# EAGLE design sh (EAGLE 9.4.2)
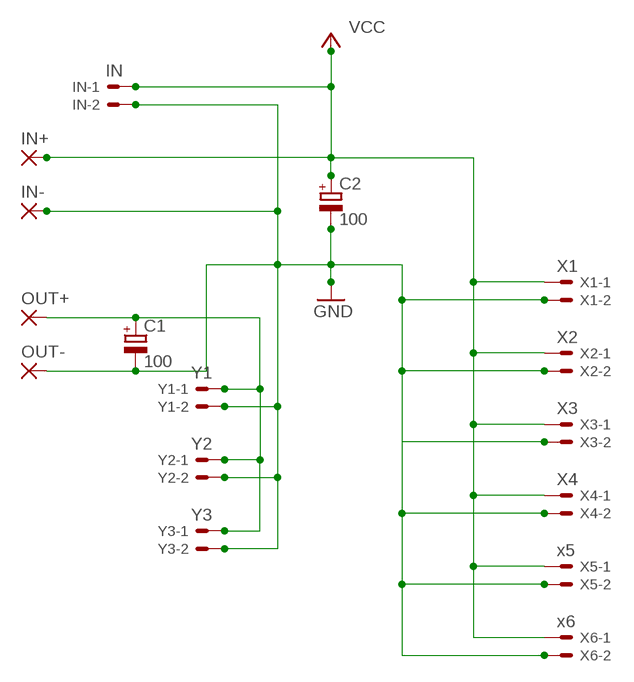
[diagram p0: schematic, sheet 1]

## Parts
C1  100  CPOL-EUE5-10.5  [E5-10,5]
C2  100  CPOL-EUE5-10.5  [E5-10,5]
IN  IN  C-GRID-02-70543  [70543-02]
IN+  3,17/1,3  [3,17/1,3]
IN-  3,17/1,3  [3,17/1,3]
OUT+  3,17/1,3  [3,17/1,3]
OUT-  3,17/1,3  [3,17/1,3]
X1  X1  C-GRID-02-70543  [70543-02]
X2  X2  C-GRID-02-70543  [70543-02]
X3  X3  C-GRID-02-70543  [70543-02]
X4  X4  C-GRID-02-70543  [70543-02]
X5  x5  C-GRID-02-70543  [70543-02]
X6  x6  C-GRID-02-70543  [70543-02]
Y1  Y1  C-GRID-02-70543  [70543-02]
Y2  Y2  C-GRID-02-70543  [70543-02]
Y3  Y3  C-GRID-02-70543  [70543-02]

## Nets
GND: C1.- C2.- IN-.1(P) IN.2 OUT-.1(P) X1.2 X2.2 X3.2 X4.2 X5.2 X6.2 Y1.2 Y2.2 Y3.2
N$3: C1.+ OUT+.1(P) Y1.1 Y2.1 Y3.1
VCC: C2.+ IN+.1(P) IN.1 X1.1 X2.1 X3.1 X4.1 X5.1 X6.1

## Library data of the parts
C1 C2 = rcl:CPOL-EU: POLARIZED CAPACITOR, European symbol; SPICEPREFIX: C
IN Y1-Y3 = con-molex:C-GRID-02: CONNECTOR wire to board 2.54 mm (0.100") pitch header; MF: MOLEX; OC_FARNELL: unknown; OC_NEWARK: unknown
IN+ IN- OUT+ OUT- = wirepad:3,17/1,3: THROUGH-HOLE PAD
X1-X6 = con-molex:C-GRID-02: CONNECTOR wire to board 2.54 mm (0.100") pitch header; OC_FARNELL: unknown; OC_NEWARK: unknown

## Board
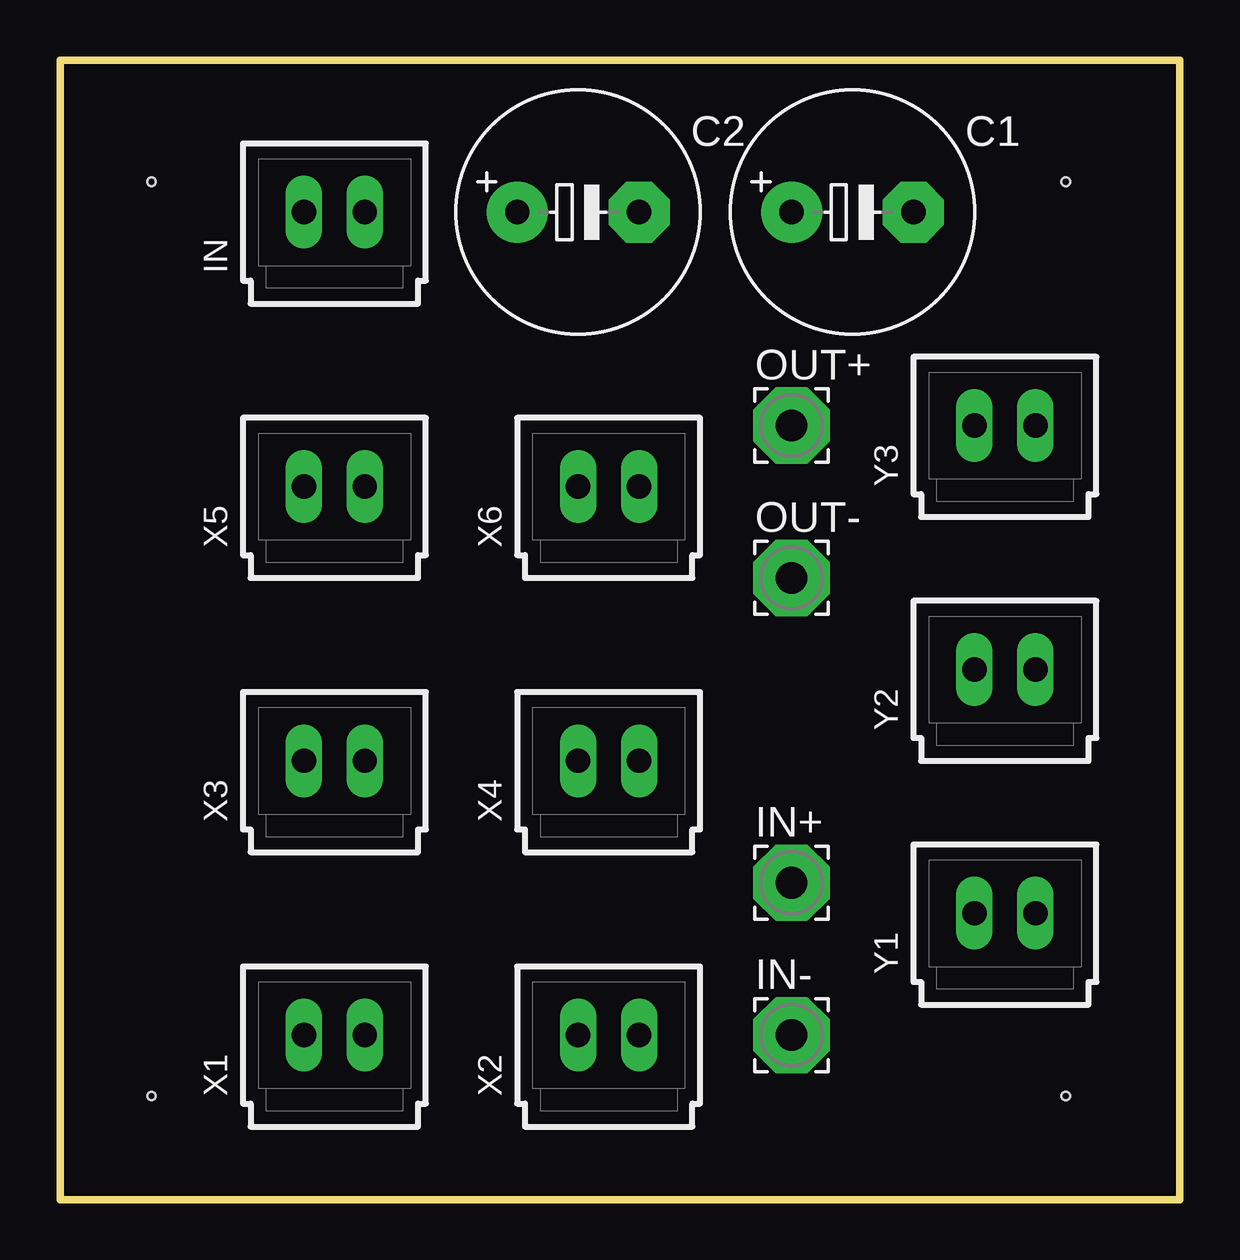
[diagram p1: board, top side]
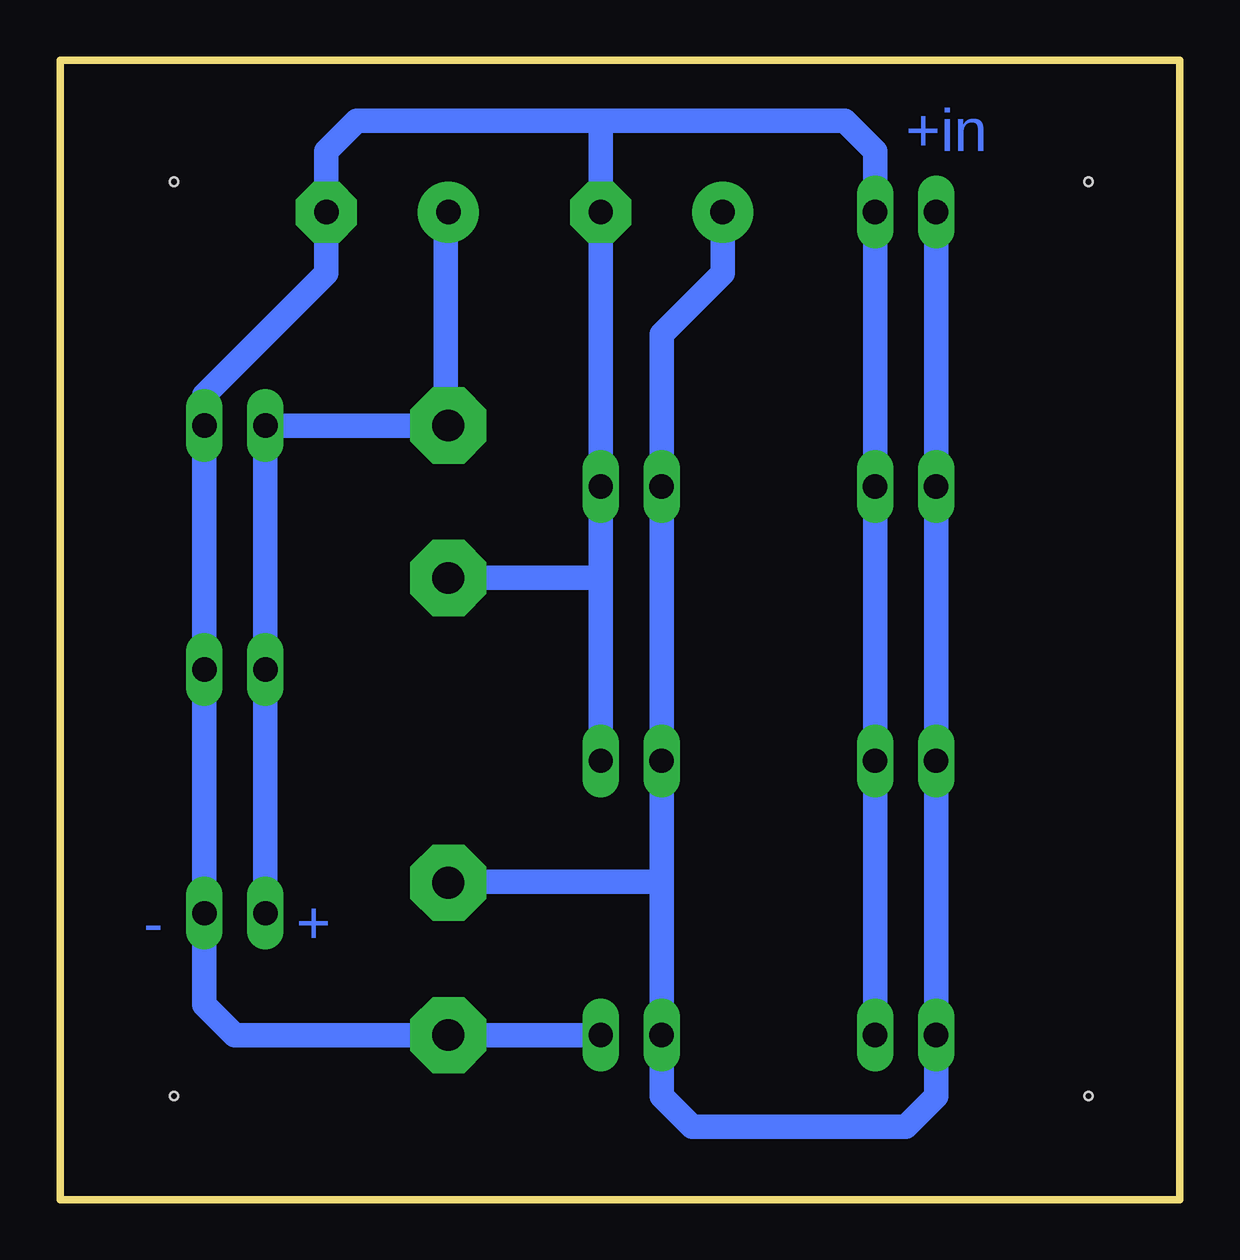
[diagram p2: board, bottom side, seen from below]

Size 46.66 x 47.49 mm. Coordinates in mm from the lower left corner, seen from the top.
Outline: 0,0 46.66,0 46.66,47.49 0,47.49 0,0
Copper layers (1*16): Top 0.035mm / dielectric 1.5mm / Bottom 0.035mm
Design rules "default": minimum track width 6mil, minimum drill 0.35mm, track to track 6mil, track to pad 6mil, pad to pad 6mil, via to via 6mil, smd to smd 6mil, copper to edge 40mil, drill to drill 6mil, minimum pad ring 10mil, minimum via ring 8mil, stop-mask expansion 4mil, vias tented up to drill 0mil, thermal gap 10mil
Holes 0.35 mm at 3.81,42.42 41.91,42.42 41.91,4.32 3.81,4.32

### Footprints (pad centres in the part's own frame; a part is rotated, then mirrored left to right if it is on the bottom)
E5-10,5 = drill 1.016 pad 2.54: + -2.54,0 | drill 1.016 pad 2.54 octagon: - 2.54,0
70543-02 = drill 1.016 long: 1 -1.27,0; 2 1.27,0
3,17/1,3 = drill 1.321 pad 3.175 octagon: 1 0,0

### Placement (x,y rotation side)
C1  33.02,41.15 0 top
C2  21.59,41.15 0 top
IN  11.43,41.15 0 top
IN+  30.48,13.21 0 top
IN-  30.48,6.86 0 top
OUT+  30.48,32.26 0 top
OUT-  30.48,25.91 0 top
X1  11.43,6.86 0 top
X2  22.86,6.86 0 top
X3  11.43,18.29 0 top
X4  22.86,18.29 0 top
X5  11.43,29.72 0 top
X6  22.86,29.72 0 top
Y1  39.37,11.94 0 top
Y2  39.37,22.1 0 top
Y3  39.37,32.26 0 top

### Tracks (layer width: path | path; a pad name or v marks a point on that pad's centre or on a via)
GND
  Bottom 0.152: 12.75,29.72 X5.2 | 40.69,11.89 Y1.2 | 30.53,25.96 OUT-.1 | 35.61,41.1 C1.- | 40.69,12.04 Y1.2 | X5.2 12.75,29.77 X5.2 | 12.75,41.15 IN.2 | 12.75,6.96 X1.2 12.75,6.81 | 12.75,18.29 X3.2 | X5.2 12.75,29.62 X5.2 | 12.75,18.29 X3.2 | 24.23,6.96 X2.2 24.18,7.32 | 24.23,29.77 X6.2 | 12.75,41.15 IN.2 | 35.46,41.25 C1.- | 12.75,18.29 X3.2 | 12.75,41.15 IN.2 | 30.43,25.91 OUT-.1 | C2.- 24.03,41.15 C2.- | 12.75,41.15 IN.2 | 40.64,12.04 Y1.2 | 24.18,41.15 C2.- | C1.- 35.46,41.3 C1.- | 30.43,25.91 OUT-.1 | 24.18,29.72 X6.2 | 12.75,18.29 X3.2 | 12.75,18.29 12.75,29.57 X5.2 | 12.75,18.29 X3.2 | 12.75,29.72 12.75,41.15 | 12.75,41.15 IN.2 | 12.75,29.72 X5.2 | 30.43,25.91 OUT-.1 | 24.18,29.72 X6.2 | 24.18,29.72 24.18,41.15 | 24.18,41.15 C2.- | 24.18,29.72 X6.2 | 35.61,41.15 C1.- | 24.18,41.15 C2.- | 12.75,41.15 IN.2 | 40.64,32.16 Y3.2 40.64,32.16 | 24.18,18.29 X4.2 24.18,18.29
  Bottom 1.016: X2.2 IN-.1 39.37,6.86 40.64,8.13 Y1.2 Y2.2 40.64,32.16 40.64,33.53 35.56,38.61 C1.- 35.56,43.69 34.29,44.96 25.4,44.96 24.13,44.96 | X1.2 12.7,18.24 12.75,18.29 | X3.2 12.7,29.67 12.75,29.72 | X5.2 12.7,41.1 12.75,41.15 | 24.03,41.15 24.13,41.05 X6.2 24.13,25.91 | IN.2 12.7,43.69 13.97,44.96 24.13,44.96 | C2.- 24.13,44.96 | X4.2 24.13,25.91 | OUT-.1 24.13,25.91
N$3
  Bottom 0.152: 30.58,41.1 C1.+ | 38.2,22.1 Y2.1 | 30.58,32.31 OUT+.1 | 30.58,41.15 C1.+ | 30.58,32.31 OUT+.1 | 38.2,22.1 Y2.1 | 38.2,12.04 Y1.1 | 38.2,22.1 Y2.1 | 30.58,32.31 OUT+.1 | 38.2,22.1 38.2,32.16 Y3.1 | 38.2,22.1 Y2.1 | 30.58,32.31 30.58,33.53 30.58,41.15 | 30.58,41.15 C1.+ | 30.58,32.31 OUT+.1
  Bottom 1.016: Y1.1 38.1,22 | 38.1,22 38.2,22.1 | 38.1,22 Y2.1 Y3.1 30.63,32.26 30.58,32.31 | 30.58,41.15 30.58,33.53 30.58,32.36 OUT+.1
VCC
  Bottom 0.152: 10.16,6.81 X1.1 | 21.49,6.81 X2.1 | 19.15,41.15 C2.+ | 30.43,13.26 IN+.1 30.58,13.26 | 19.15,41.15 C2.+ | 19.15,41.15 C2.+
  Bottom 1.016: IN.1 X5.1 X3.1 X1.1 10.16,4.32 11.43,3.05 19.05,3.05 20.32,3.05 21.59,4.32 X2.1 21.59,13.26 | 21.59,13.26 X4.1 X6.1 21.59,36.07 19.05,38.61 C2.+ | IN+.1 30.43,13.26 21.59,13.26

### Text on the board
Bottom: +in | + | -